# EAGLE design mother_board_v3.0 (EAGLE 7.5.0)
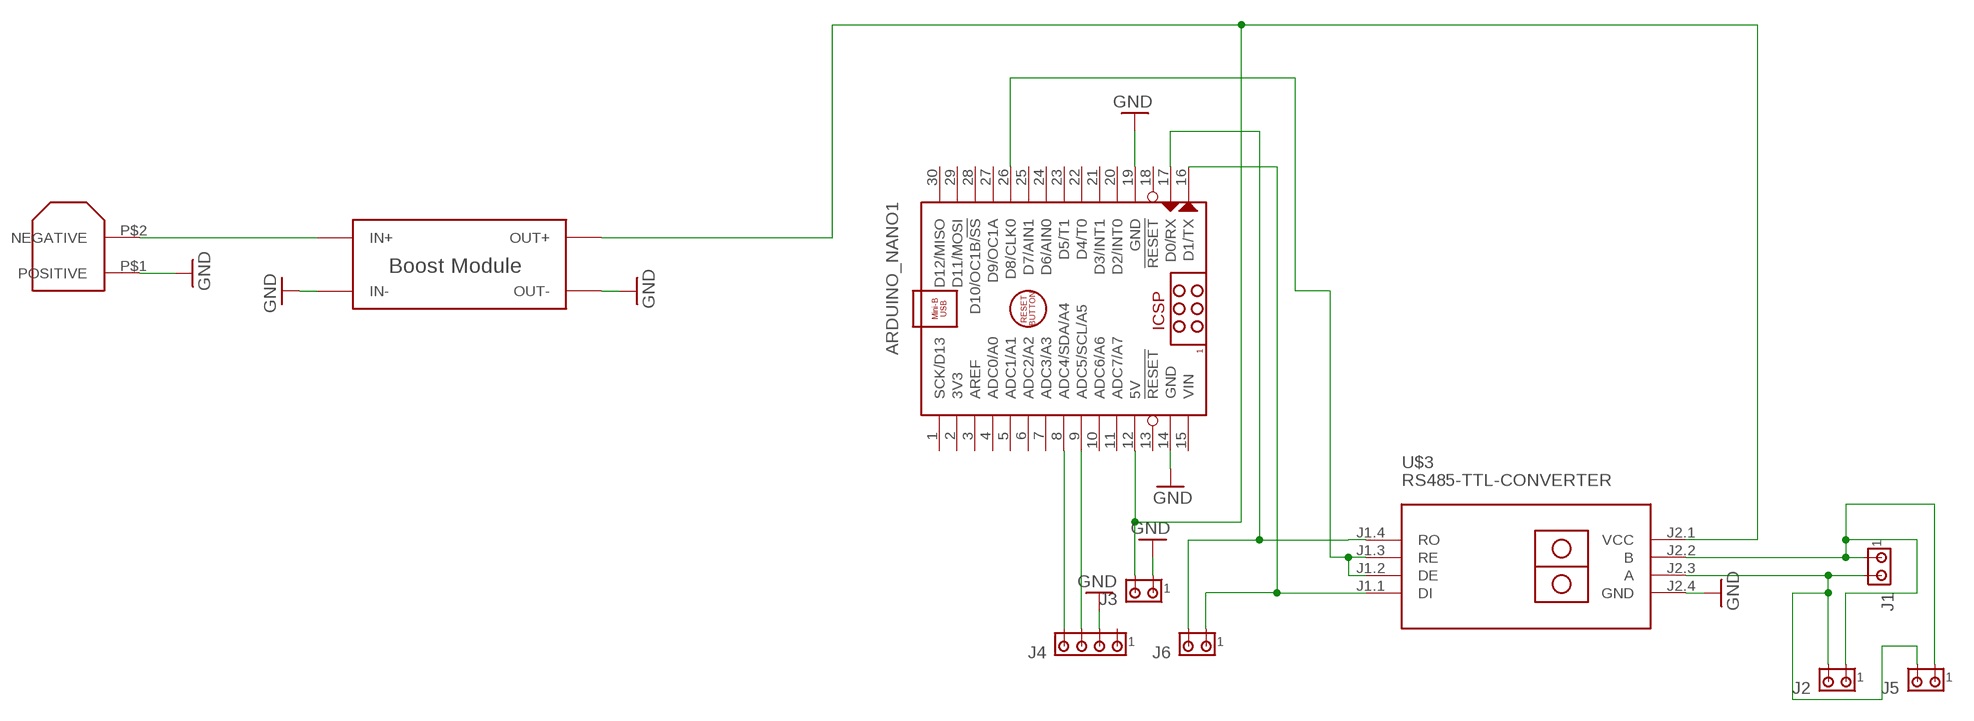
[diagram p0: schematic, sheet 1]

## Parts
ARDUINO_NANO1  ARDUINO_NANO  [ARDUINO_NANO]
J1  MTA02-100  [10X02MTA]
J2  MTA02-100  [10X02MTA]
J3  MTA02-100  [10X02MTA]
J4  MTA04-100  [10X04MTA]
J5  MTA02-100  [10X02MTA]
J6  MTA02-100  [10X02MTA]
U$3  RS485-TTL-CONVERTER  [RS485-TTL-CONVERTER]
U$5  BOOST_MODULE  [BOOST_MODULE]
U$6  XT60  [CONNECTOR]

## Nets
GND: ARDUINO_NANO1.14(GND) ARDUINO_NANO1.19(GND) J3.1 J4.2 U$3.J2.4(GND) U$5.IN- U$5.OUT- U$6.P$1(POSITIVE)
N$1: U$5.IN+ U$6.P$2(NEGATIVE)
N$4: J1.2 J2.2 J5.2 U$3.J2.3(A)
N$5: J1.1 J2.1 J5.1 U$3.J2.2(B)
N$6: ARDUINO_NANO1.26(D8/CLK0) U$3.J1.2(DE) U$3.J1.3(RE)
N$7: ARDUINO_NANO1.12(5V) J3.2 U$3.J2.1(VCC) U$5.OUT+
N$12: ARDUINO_NANO1.9(ADC5/SCL/A5) J4.3
N$14: ARDUINO_NANO1.17(D0/RX) J6.2
N$17: U$3.J1.4(RO)
N$19: ARDUINO_NANO1.8(ADC4/SDA/A4) J4.4
N$22: ARDUINO_NANO1.16(D1/TX) J6.1 U$3.J1.1(DI)
Unconnected: ARDUINO_NANO1.1(SCK/D13) ARDUINO_NANO1.2(3V3) ARDUINO_NANO1.3(AREF) ARDUINO_NANO1.4(ADC0/A0) ARDUINO_NANO1.5(ADC1/A1) ARDUINO_NANO1.6(ADC2/A2) ARDUINO_NANO1.7(ADC3/A3) ARDUINO_NANO1.10(ADC6/A6) ARDUINO_NANO1.11(ADC7/A7) ARDUINO_NANO1.13(!RESET) ARDUINO_NANO1.18(!RESET) ARDUINO_NANO1.20(D2/INT0) ARDUINO_NANO1.21(D3/INT1) ARDUINO_NANO1.22(D4/T0) ARDUINO_NANO1.23(D5/T1) ARDUINO_NANO1.24(D6/AIN0) ARDUINO_NANO1.25(D7/AIN1) ARDUINO_NANO1.27(D9/OC1A) ARDUINO_NANO1.28(D10/OC1B/!SS) ARDUINO_NANO1.29(D11/MOSI) ARDUINO_NANO1.30(D12/MISO) J4.1

## Power pins joined to a net without a drawn wire
VIN: ARDUINO_NANO1.15(VIN)

## Library data of the parts
ARDUINO_NANO1 = ArduinoNanoV30:ARDUINO_NANO: Arduino Nano V3.0 Module Overview: The Arduino Nano is a small, complete, and breadboard-friendly board based on the ATmega328 (Arduino Nano 3.x) or ATmega168 (Arduino Nano 2.x). It has more or less the same functionality of the Arduino Duemilanove, but in a different package. It lacks only a DC power jack, and works with a Mini-B USB cable instead of a standard one. The Nano was designed and is being produced by Gravitech <http://www.gravitech.us/arna30wiatp.html>. General specifications: Item Value Microcontroller Atmel ATmega168 or ATmega328 Operating Voltage (logic level) 5 V Input Voltage (recommended) 7-12 V Input Voltage (limits) 6-20 V Digital I/O Pins 14 (of which 6 provide PWM output) Analog Input Pins 8 DC Current per I/O Pin 40 mA Flash Memory 16 KB (ATmega168) or 32 KB (ATmega328) of which 2 KB used by bootloader SRAM 1 KB (ATmega168) or 2 KB (ATmega328) EEPROM 512 bytes (ATmega168) or 1 KB (ATmega328) Clock Speed 16 MHz Dimensions (Inches) 0.73" x 1.70" Dimensions (mm) 18mm x 45mm Overall height About 9 mm (not including pins) Weigth 5 g Power: The Arduino Nano can be powered via the Mini-B USB connection, 6-20V unregulated external power supply (pin 30), or 5V regulated external power supply (pin 27). The power source is automatically selected to the highest voltage source. Memory: The ATmega168 has 16 KB of flash memory for storing code (of which 2 KB is used for the bootloader); the ATmega328 has 32 KB, (also with 2 KB used for the bootloader). The ATmega168 has 1 KB of SRAM and 512 bytes of EEPROM (which can be read and written with the EEPROM library); the ATmega328 has 2 KB of SRAM and 1 KB of EEPROM. Input and Output: Each of the 14 digital pins on the Nano can be used as an input or output, using pinMode(), digitalWrite(), and digitalRead() functions. They operate at 5 volts. Each pin can provide or receive a maximum of 40 mA and has an internal pull-up resistor (disconnected by default) of 20-50 kOhms. In addition, some pins have specialized functions. Visit Arduino - ArduinoBoardNano <https://www.arduino.cc/en/Main/ArduinoBoardNano>
J1-J3 J5 J6 = con-amp:MTA02-100: AMP connector
J4 = con-amp:MTA04-100: AMP connector
U$3 = diy-modules:RS485-TTL-CONVERTER: RS485 to TTL converter based on MAX485 chip
U$5 = Boost Module:BOOST_MODULE
U$6 = xt60_V2:XT60

## Board
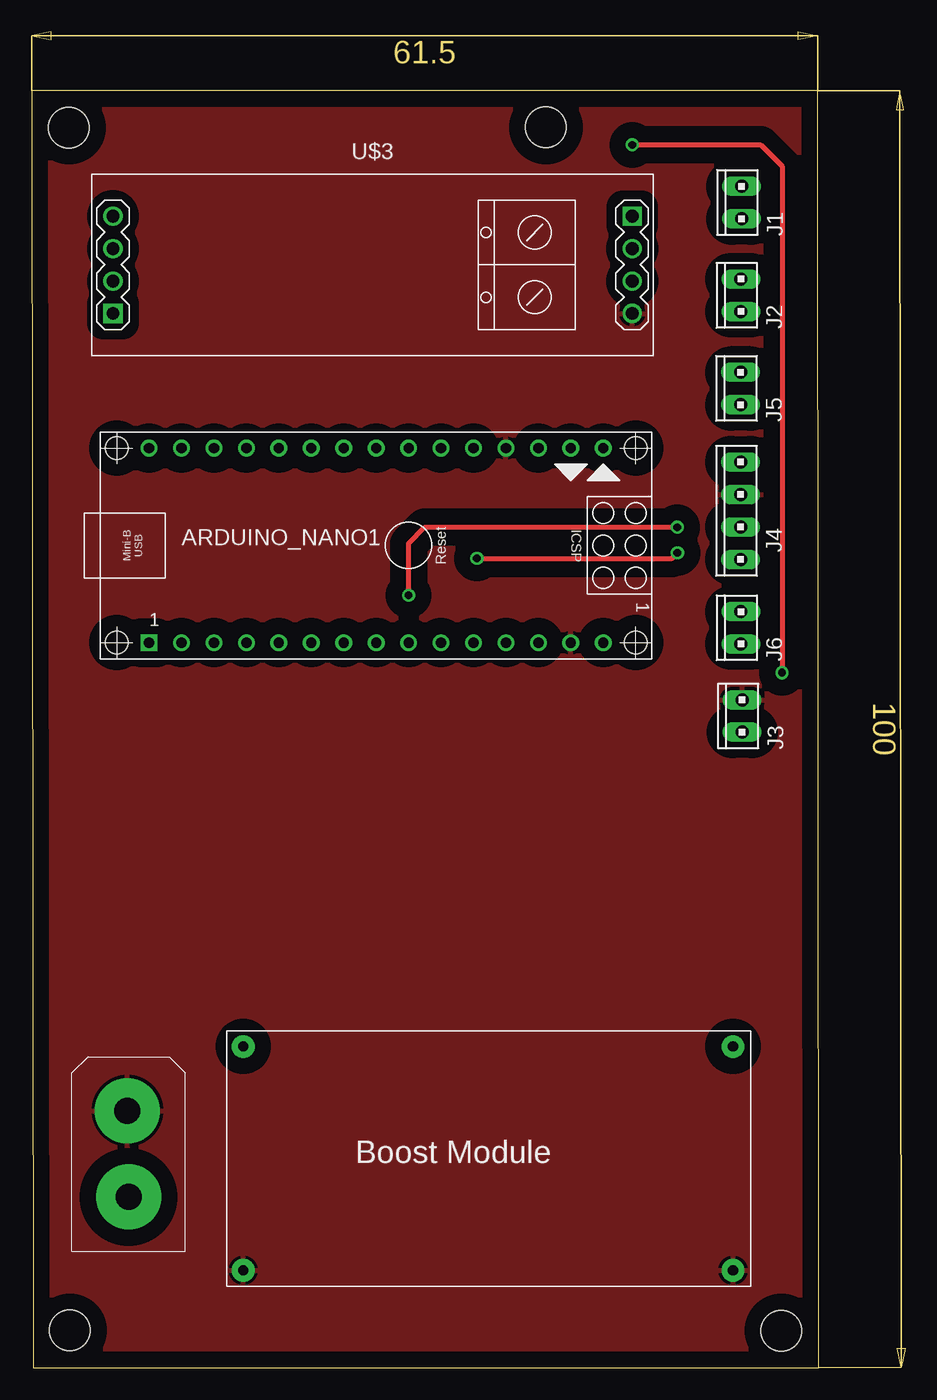
[diagram p1: board, top side]
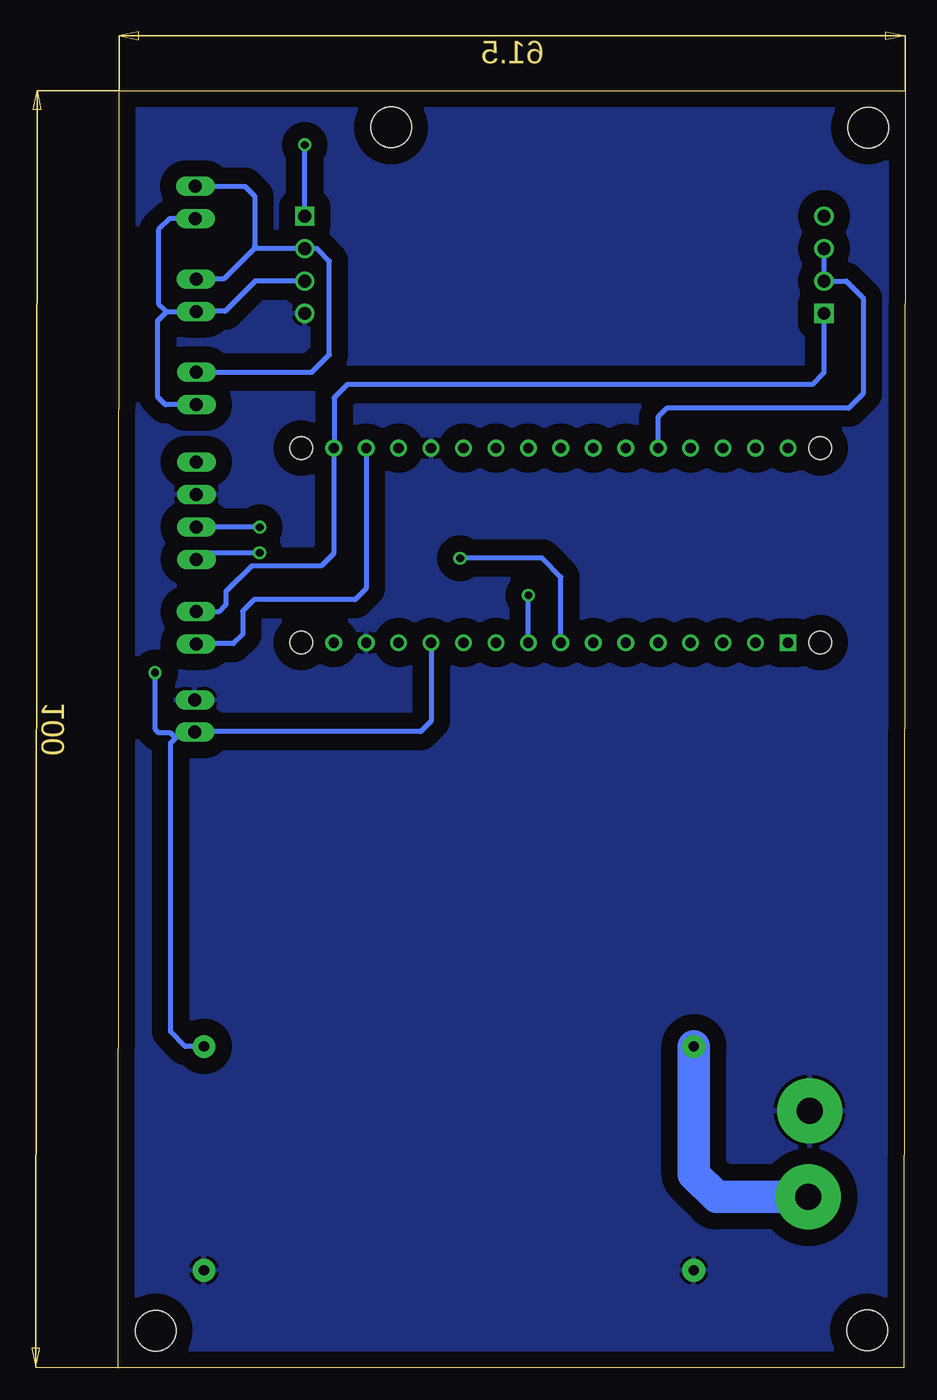
[diagram p2: board, bottom side, seen from below]

Size 61.6 x 100 mm. Coordinates in mm from the lower left corner, seen from the top.
Outline: 0.1,0 61.6,0 61.5,100 0,100 0.1,0
Copper layers (1*16): Top 0.035mm / dielectric 1.5mm / Bottom 0.035mm
Design rules "default": minimum track width 10mil, minimum drill 24mil, track to track 8mil, track to pad 8mil, pad to pad 8mil, via to via 8mil, smd to smd 8mil, copper to edge 40mil, drill to drill 8mil, minimum pad ring 10mil, minimum via ring 8mil, stop-mask expansion 4mil, vias tented up to drill 0mil, thermal gap 10mil
Holes 3.2 mm at 2.9,97.1 2.97,2.92 58.67,2.9 40.23,97.13

### Footprints (pad centres in the part's own frame; a part is rotated, then mirrored left to right if it is on the bottom)
ARDUINO_NANO = drill 0.8 square: 1 -20.32,-7.62 | drill 0.8: 2 -17.78,-7.62; 3 -15.24,-7.62; 4 -12.7,-7.62; 5 -10.16,-7.62; 6 -7.62,-7.62; 7 -5.08,-7.62; 8 -2.54,-7.62; 9 0,-7.62; 10 2.54,-7.62; 11 5.08,-7.62; 12 7.62,-7.62; 13 10.16,-7.62; 14 12.7,-7.62; 15 15.24,-7.62; 16 15.24,7.62; 17 12.7,7.62; 18 10.16,7.62; 19 7.62,7.62; 20 5.08,7.62; 21 2.54,7.62; 22 0,7.62; 23 -2.54,7.62; 24 -5.08,7.62; 25 -7.62,7.62; 26 -10.16,7.62; 27 -12.7,7.62; 28 -15.24,7.62; 29 -17.78,7.62; 30 -20.32,7.62 | hole 1.778: -22.86,-7.62; -22.86,7.62; 17.78,7.62; 17.78,-7.62
10X02MTA = drill 1.016 long: 1 1.27,0; 2 -1.27,0
10X04MTA = drill 1.016 long: 1 3.81,0; 2 1.27,0; 3 -1.27,0; 4 -3.81,0
RS485-TTL-CONVERTER = drill 1 square: J1.1 -20.32,-3.81; J2.1 20.32,3.81 | drill 1: J1.2 -20.32,-1.27; J1.3 -20.32,1.27; J1.4 -20.32,3.81; J2.2 20.32,1.27; J2.3 20.32,-1.27; J2.4 20.32,-3.81
BOOST_MODULE = drill 0.8 pad 1.778: IN+ 1.27,18.796; IN- 1.27,1.27; OUT+ 39.624,18.796; OUT- 39.624,1.27
CONNECTOR = drill 2.032 pad 5.08: P$1 4.343,12.294; P$2 4.445,5.537

### Placement (x,y rotation side)
ARDUINO_NANO1  29.49,64.39 0 top
J1  55.55,91.24 90 top
J2  55.5,83.97 90 top
J3  55.6,51.03 90 top
J4  55.47,67.11 90 top
J5  55.47,76.68 90 top
J6  55.5,57.94 90 top
U$3  26.67,86.36 0 top
U$5  15.27,6.35 0 top
U$6  3.12,7.82 0 top

### Tracks (layer width: path | path; a pad name or v marks a point on that pad's centre or on a via)
GND
  pour Bottom (isolate 1.27): 0,100.33 61.34,99.97 61.14,-0.03 -0.2,0.33
  pour Top (isolate 1.27): -1.37,101.96 82.27,101.96 82.27,-13.23 -1.37,-13.23
N$1
  Bottom 2.54: U$6.P$2 14.76,13.36 16.54,15.14 U$5.IN+
N$2  (via drill 0.6)
  other vias: 58.72,54.41
N$4
  Bottom 0.406: U$3.J2.3 50.88,85.09 53.24,82.73 55.47,82.73 J2.2 55.52,82.68 57.81,82.68 | J1.2 57.58,89.97 58.45,89.1 58.45,83.31 57.81,82.68 | J5.2 57.91,75.41 58.5,76 58.5,81.99 57.81,82.68
N$5
  Bottom 0.406: 50.7,87.63 U$3.J2.2 46.02,87.63 45.06,86.66 45.06,79.32 46.43,77.95 J5.1 | 50.7,87.63 50.95,87.63 53.34,85.24 J2.1 | J1.1 51.69,92.51 50.93,91.74 50.93,87.86 50.7,87.63
N$6
  Bottom 0.406: U$3.J1.3 U$3.J1.2 4.6,85.09 3.28,83.77 3.28,76.28 4.42,75.13 18.64,75.13 19.36,74.42 19.36,72.03 ARDUINO_NANO1.26
N$7  (via drill 0.6)
  Top 0.406: v46.99,95.76 57.05,95.76 58.73,94.08 v58.73,54.43
  Bottom 0.406: U$5.OUT+ 56.34,25.15 57.51,26.31 57.51,48.92 57.11,49.31 | 57.11,49.31 56.62,49.81 55.65,49.81 J3.2 55.55,49.81 37.92,49.81 37.11,50.62 ARDUINO_NANO1.12 | U$3.J2.1 v46.99,95.76 | v58.73,54.43 58.73,50.01 58.45,49.73 57.53,49.73 57.11,49.31
N$8  (via drill 0.6)
  other vias: 34.82,63.37
N$9  (via drill 0.6)
  other vias: 50.55,63.8
N$12  (via drill 0.6)
  Top 0.406: v29.49,60.48 29.49,64.54 30.76,65.81 v50.52,65.81
  Bottom 0.406: ARDUINO_NANO1.9 v29.49,60.48 | v50.52,65.81 55.45,65.81 J4.3
N$14
  Bottom 0.406: ARDUINO_NANO1.17 42.19,61.01 43.05,60.15 50.95,60.15 51.87,59.23 51.87,57.4 52.58,56.69 55.47,56.69 J6.2
N$19  (via drill 0.6)
  Top 0.406: v34.85,63.37 50.09,63.37 v50.52,63.8
  Bottom 0.406: ARDUINO_NANO1.8 26.95,61.92 28.42,63.4 34.82,63.4 v34.85,63.37 | v50.52,63.8 54.97,63.8 J4.4
N$22
  Bottom 0.406: U$3.J1.1 6.35,77.9 7.26,76.99 43.66,76.99 44.7,75.95 44.7,72.03 ARDUINO_NANO1.16 44.73,63.75 45.7,62.79 51.16,62.79 53.16,60.78 53.16,59.77 53.75,59.18 55.47,59.18 J6.1